# Altium project RedHatErrector.PrjPcb
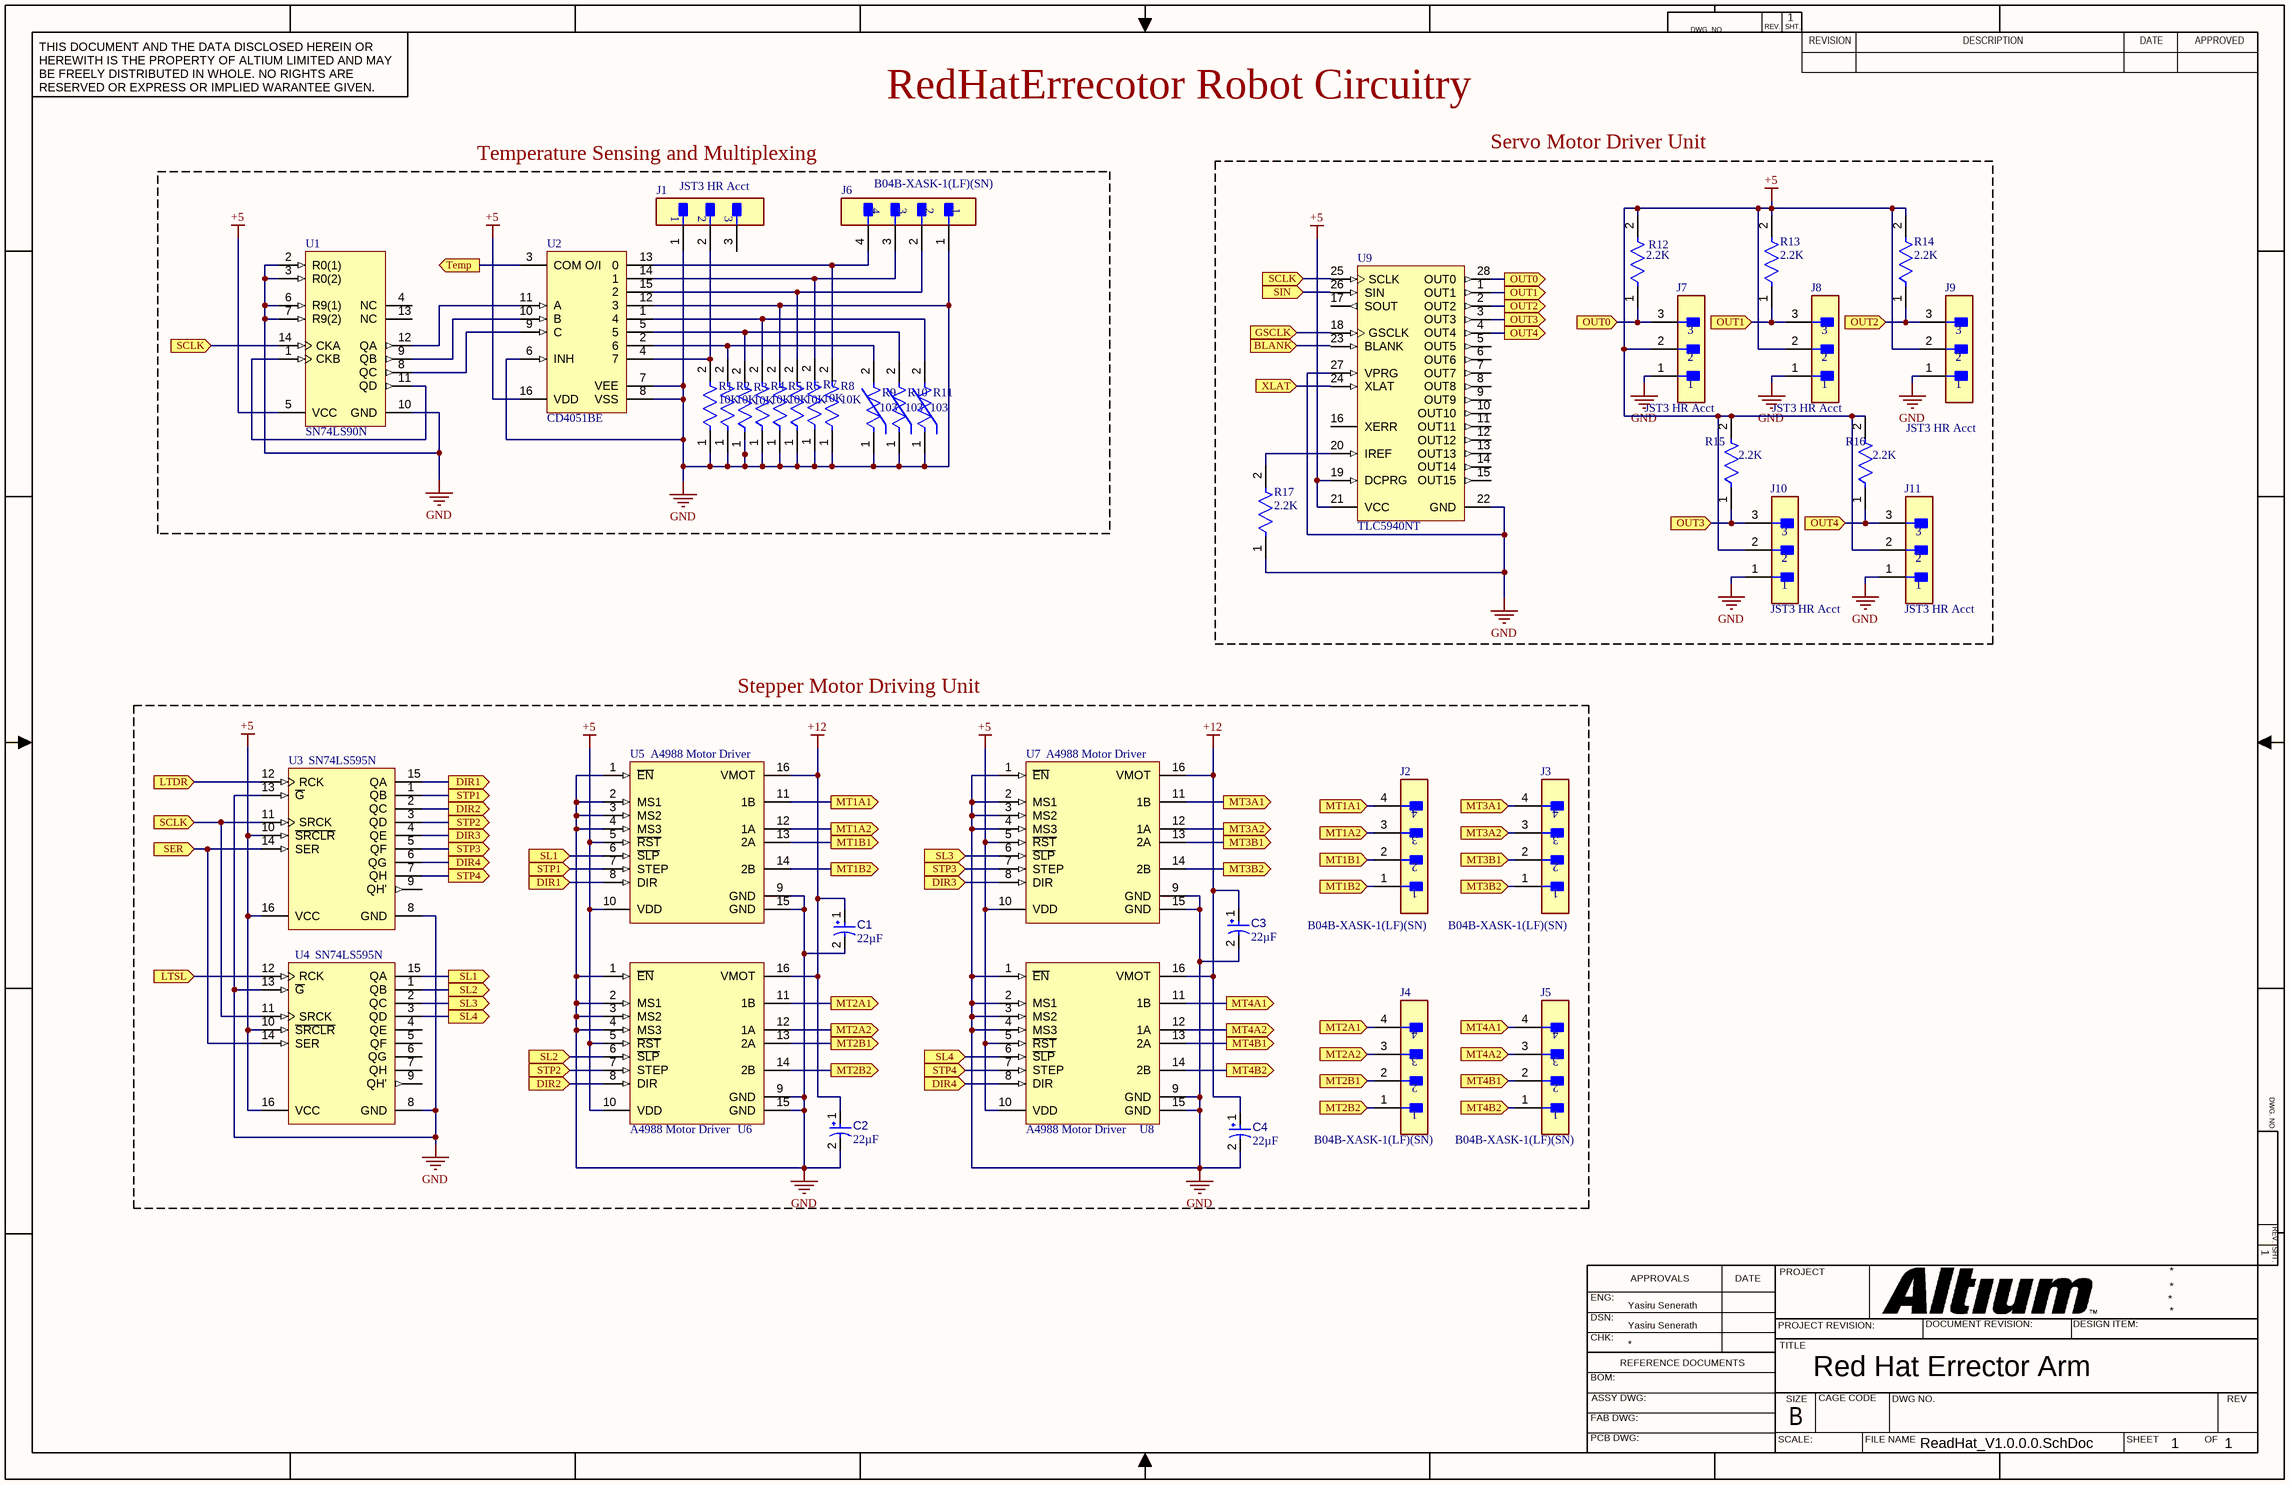
[diagram p0: ReadHat_V1.0.0.0.SchDoc]
1 sheet, 41 parts. Net scope: flat (ports and power ports of the same name join across sheets).
Board file: RedHatErrector PCB v1.0.0.0.PcbDoc

## Sheet ReadHat_V1.0.0.0.SchDoc: Red Hat Errector Arm
size 431 x 279 mm; Author: Yasiru Senerath; CompanyName: Red Hat; DrawnBy: Yasiru Senerath; Engineer: Yasiru Senerath; SheetNumber: 1; SheetTotal: 1

### Parts
C1  value 22µF  [CAPPR55-200-1100X500X1200]  (hidden comment: ECA1HM220)
C2  value 22µF  [CAPPR55-200-1100X500X1200]  (hidden comment: ECA1HM220)
C3  value 22µF  [CAPPR55-200-1100X500X1200]  (hidden comment: ECA1HM220)
C4  value 22µF  [CAPPR55-200-1100X500X1200]  (hidden comment: ECA1HM220)
J1  JST3 HR Acct  [FP-B3B-XH-A_LF_SN-MFG]
J2  B04B-XASK-1(LF)(SN)  [FP-B04B-XASK-1_LF_SN-MFG]
J3  B04B-XASK-1(LF)(SN)  [FP-B04B-XASK-1_LF_SN-MFG]
J4  B04B-XASK-1(LF)(SN)  [FP-B04B-XASK-1_LF_SN-MFG]
J5  B04B-XASK-1(LF)(SN)  [FP-B04B-XASK-1_LF_SN-MFG]
J6  B04B-XASK-1(LF)(SN)  [FP-B04B-XASK-1_LF_SN-MFG]
J7  JST3 HR Acct  [FP-B3B-XH-A_LF_SN-MFG]
J8  JST3 HR Acct  [FP-B3B-XH-A_LF_SN-MFG]
J9  JST3 HR Acct  [FP-B3B-XH-A_LF_SN-MFG]
J10  JST3 HR Acct  [FP-B3B-XH-A_LF_SN-MFG]
J11  JST3 HR Acct  [FP-B3B-XH-A_LF_SN-MFG]
R1  10K  [FP-RNC55-MFG]
R2  10K  [FP-RNC55-MFG]
R3  10K  [FP-RNC55-MFG]
R4  10K  [FP-RNC55-MFG]
R5  10K  [FP-RNC55-MFG]
R6  10K  [FP-RNC55-MFG]
R7  10K  [FP-RNC55-MFG]
R8  10K  [FP-RNC55-MFG]
R9  103  [FP-PTFL04_2N34-MFG]
R10  103  [FP-PTFL04_2N34-MFG]
R11  103  [FP-PTFL04_2N34-MFG]
R12  2.2K  [FP-RNC55-MFG]
R13  2.2K  [FP-RNC55-MFG]
R14  2.2K  [FP-RNC55-MFG]
R15  2.2K  [FP-RNC55-MFG]
R16  2.2K  [FP-RNC55-MFG]
R17  2.2K  [FP-RNC55-MFG]
U1  SN74LS90N  [N0014A]
U2  CD4051BE  [N0016A]
U3  SN74LS595N  [N0016A]
U4  SN74LS595N  [N0016A]
U5  A4988 Motor Driver  [Polo-A4988 Motor Driver_V]
U6  A4988 Motor Driver  [Polo-A4988 Motor Driver_V]
U7  A4988 Motor Driver  [Polo-A4988 Motor Driver_V]
U8  A4988 Motor Driver  [Polo-A4988 Motor Driver_V]
U9  TLC5940NT  [NT0028A]

### Blocks framed on the sheet
Servo Motor Driver Unit: J7-J11 R12-R17 U9
Temperature Sensing and Multiplexing: J1 J6 R1-R11 U1 U2
Stepper Motor Driving Unit: C1-C4 J2-J5 U3-U8

### Ports
BLANK (in), DIR1 (in), DIR1 (out), DIR2 (in), DIR2 (out), DIR3 (in), DIR3 (out), DIR4 (in), DIR4 (out), GSCLK (in), LTDR (in), LTSL (in), MT1A1 (in), MT1A1 (out), MT1A2 (in), MT1A2 (out), MT1B1 (in), MT1B1 (out), MT1B2 (in), MT1B2 (out), MT2A1 (in), MT2A1 (out), MT2A2 (in), MT2A2 (out), MT2B1 (in), MT2B1 (out), MT2B2 (in), MT2B2 (out), MT3A1 (in), MT3A1 (out), MT3A2 (in), MT3A2 (out), MT3B1 (in), MT3B1 (out), MT3B2 (in), MT3B2 (out), MT4A1 (in), MT4A1 (out), MT4A2 (in), MT4A2 (out), MT4B1 (in), MT4B1 (out), MT4B2 (in), MT4B2 (out), OUT0 (in), OUT0 (out), OUT1 (in), OUT1 (out), OUT2 (in), OUT2 (out), OUT3 (in), OUT3 (out), OUT4 (in), OUT4 (out), SCLK (in), SER (in), SIN (in), SL1 (in), SL1 (out), SL2 (in), SL2 (out), SL3 (in), SL3 (out), SL4 (in), SL4 (out), STP1 (in), STP1 (out), STP2 (in), STP2 (out), STP3 (in), STP3 (out), STP4 (in), STP4 (out), Temp (out), XLAT (in)

### Nets
+5: J7.2 J8.2 J9.2 J10.2 J11.2 R12.2 R13.2 R14.2 R15.2 R16.2 U1.5(VCC) U2.16(VDD) U3.10(~{SRCLR}) U3.16(VCC) U4.10(~{SRCLR}) U4.16(VCC) U5.5(~{RST}) U5.10(VDD) U6.5(~{RST}) U6.10(VDD) U7.5(~{RST}) U7.10(VDD) U8.5(~{RST}) U8.10(VDD) U9.19(DCPRG) U9.21(VCC)
+12: C1.1 C2.1 C3.1 C4.1 U5.16(VMOT) U6.16(VMOT) U7.16(VMOT) U8.16(VMOT)
GND: C1.2 C2.2 C3.2 C4.2 J1.1 J6.1 J7.1 J8.1 J9.1 J10.1 J11.1 R1.1 R2.1 R3.1 R4.1 R5.1 R5.2 R6.1 R7.1 R8.1 R9.1 R10.1 R11.1 R17.1 U1.2(R0(1)) U1.3(R0(2)) U1.6(R9(1)) U1.7(R9(2)) U1.10(GND) U2.6(INH) U2.7(VEE) U2.8(VSS) U2.12(3) U3.8(GND) U3.13(~{G}) U4.8(GND) U4.13(~{G}) U5.1(~{EN}) U5.2(MS1) U5.3(MS2) U5.4(MS3) U5.9(GND) U5.15(GND) U6.1(~{EN}) U6.2(MS1) U6.3(MS2) U6.4(MS3) U6.9(GND) U6.15(GND) U7.1(~{EN}) U7.2(MS1) U7.3(MS2) U7.4(MS3) U7.9(GND) U7.15(GND) U8.1(~{EN}) U8.2(MS1) U8.3(MS2) U8.4(MS3) U8.9(GND) U8.15(GND) U9.22(GND) U9.27(VPRG)
NetJ1_2: J1.2 R1.2 U2.4(7)
NetJ2_1: J2.1 U5.14(2B) ; port MT1B2
NetJ2_2: J2.2 U5.13(2A) ; port MT1B1
NetJ2_3: J2.3 U5.12(1A) ; port MT1A2
NetJ2_4: J2.4 U5.11(1B) ; port MT1A1
NetJ3_1: J3.1 U7.14(2B) ; port MT3B2
NetJ3_2: J3.2 U7.13(2A) ; port MT3B1
NetJ3_3: J3.3 U7.12(1A) ; port MT3A2
NetJ3_4: J3.4 U7.11(1B) ; port MT3A1
NetJ4_1: J4.1 U6.14(2B) ; port MT2B2
NetJ4_2: J4.2 U6.13(2A) ; port MT2B1
NetJ4_3: J4.3 U6.12(1A) ; port MT2A2
NetJ4_4: J4.4 U6.11(1B) ; port MT2A1
NetJ5_1: J5.1 U8.14(2B) ; port MT4B2
NetJ5_2: J5.2 U8.13(2A) ; port MT4B1
NetJ5_3: J5.3 U8.12(1A) ; port MT4A2
NetJ5_4: J5.4 U8.11(1B) ; port MT4A1
NetJ6_2: J6.2 R6.2 U2.15(2)
NetJ6_3: J6.3 R7.2 U2.14(1)
NetJ6_4: J6.4 R8.2 U2.13(0)
NetJ7_3: J7.3 R12.1 U9.28(OUT0) ; port OUT0
NetJ8_3: J8.3 R13.1 U9.1(OUT1) ; port OUT1
NetJ9_3: J9.3 R14.1 U9.2(OUT2) ; port OUT2
NetJ10_3: J10.3 R15.1 U9.3(OUT3) ; port OUT3
NetJ11_3: J11.3 R16.1 U9.4(OUT4) ; port OUT4
NetR2_2: R2.2 R9.2 U2.2(6)
NetR3_2: R3.2 R10.2 U2.5
NetR4_2: R4.2 R11.2 U2.1(4)
NetR17_2: R17.2 U9.20(IREF)
NetU1_1: U1.1(CKB) U1.11(QD)
NetU1_8: U1.8(QC) U2.9(C)
NetU1_9: U1.9(QB) U2.10(B)
NetU1_12: U1.12(QA) U2.11(A)
NetU1_14: U1.14(CKA) U3.11(SRCK) U4.11(SRCK) U9.25(SCLK) ; port SCLK
NetU2_3: U2.3(COM_O/I) ; port Temp
NetU3_1: U3.1(QB) U5.7(STEP) ; port STP1
NetU3_2: U3.2(QC) U6.8(DIR) ; port DIR2
NetU3_3: U3.3(QD) U6.7(STEP) ; port STP2
NetU3_4: U3.4(QE) U7.8(DIR) ; port DIR3
NetU3_5: U3.5(QF) U7.7(STEP) ; port STP3
NetU3_6: U3.6(QG) U8.8(DIR) ; port DIR4
NetU3_7: U3.7(QH) U8.7(STEP) ; port STP4
NetU3_12: U3.12(RCK) ; port LTDR
NetU3_14: U3.14(SER) U4.14(SER) ; port SER
NetU3_15: U3.15(QA) U5.8(DIR) ; port DIR1
NetU4_1: U4.1(QB) U6.6(~{SLP}) ; port SL2
NetU4_2: U4.2(QC) U7.6(~{SLP}) ; port SL3
NetU4_3: U4.3(QD) U8.6(~{SLP}) ; port SL4
NetU4_12: U4.12(RCK) ; port LTSL
NetU4_15: U4.15(QA) U5.6(~{SLP}) ; port SL1
NetU9_18: U9.18(GSCLK) ; port GSCLK
NetU9_24: U9.24(XLAT) ; port XLAT

Not connected (* = marked no-connect by the designer): J1 3; U1 4(NC) 13(NC); U3 9(QH'); U4 4(QE) 5(QF) 6(QG) 7(QH) 9(QH'); U9 5(OUT5) 6(OUT6) 7(OUT7) 8(OUT8) 9(OUT9) 10(OUT10) 11(OUT11) 12(OUT12) 13(OUT13) 14(OUT14) 15(OUT15) 16(XERR) 17(SOUT) 23(BLANK) 26(SIN)

### Notes on the sheet
- RedHatErrecotor Robot Circuitry
- DWG. NO.
- REV.
- SHT.
- THIS DOCUMENT AND THE DATA DISCLOSED HEREIN OR HEREWITH IS THE PROPERTY OF ALTIUM LIMITED AND MAY BE FREELY DISTRIBUTED IN WHOLE. NO RIGHTS ARE RESERVED OR EXPRESS OR IMPLIED WARANTEE GIVEN.
- REVISION
- DESCRIPTION
- DATE
- APPROVED
- ENG:
- APPROVALS
- PROJECT
- DSN:
- CHK:
- REFERENCE DOCUMENTS
- PROJECT REVISION:
- TITLE
- DOCUMENT REVISION:
- DESIGN ITEM:
- BOM:
- FAB DWG:
- PCB DWG:
- ASSY DWG:
- SCALE:
- SIZE
- B
- CAGE CODE
- FILE NAME
- DWG NO.
- SHEET
- OF
- REV

### Library data of the parts
C1-C4 = CMP-001-00027-7: Aluminum Electrolytic Capacitor, 22 uF, +/- 20%, 50 V, -40 to 85 degC, 2-Pin THD, RoHS, Bulk; Manufacturer: Panasonic; Ripple Current (AC): 100mA; Voltage Rating: 50V; Pins: 2; Case/Package: Radial; Datasheet Version: Rev. 05, 10/2016; RoHS Compliant: True; Max Operating Temperature: 85°C; Ripple Current: 100mA; Capacitor Type: Electrolytic; Mounting Technology: TH; Package Quantity: 200; Package Reference: CAPPR55-200-1100X500X1200; Package Description: 2-Pin Radial Lead, Dia 5 mm, Height 12 mm; Packaging: Bulk; Lead Pitch: 2mm; Min Operating Temperature: -40°C; Diameter: 5mm; Tolerance: 20%; Datasheet URL: https://industrial.panasonic.com/cdbs/www-data/pdf/RDF0000/ABA0000C1218.pdf; Manufacturer URL: http://www.panasonic.com/
J1 J7-J11 = CMP-17439-000014-2: CONN HEADER VERT 3POS 2.5MM; Number of Positions: 3; Contact Resistance: 20mR; Max Current Rating: 3A; Gender: Male; Wire/Cable Gauge: 22AWG; Insulation Resistance: 1GR; Max Voltage Rating (DC): 250V; REACH SVHC: No SVHC; Lead Free: Lead Free; Packaging: Bulk; Pitch: 2.5mm; Housing Color: White; Number of Rows: 1; Housing Material: Polyamide; Termination: Solder; Series: XH; Fastening Type: Detent; Contact Plating: Tin; Contact Finish - Mating: TIN; Insulation Material: Nylon; Number of Contacts: 3; Max Operating Temperature: 85°C; Color: Natural; Contact Type: Male Pin; Mount: Through Hole; Current Rating: 3A; Orientation: Straight; Min Operating Temperature: -25°C; Connector Type: Header; Lead Pitch: 2.5mm; Contact Material: Brass; Length: 9.9mm; Insulation Color: Natural; Voltage Rating (AC): 250V; Max Voltage Rating (AC): 250V; Contact Shape: Square; Flammability Rating: UL94 V-0; Depth: 5.75mm; Voltage Rating: 250V
J2-J6 = CMP-17439-000018-1: CONN HEADER VERT 4POS 2.5MM; Manufacturer: JST; Current Rating: 3A; Voltage Rating: 250V; Conn Orientation: Straight; Conn Gender: Male; Number Of Contacts: 4; ComponentLink2Description: Datasheet; Package: B04B-XASK-1(LF)(SN); Octopart: https://octopart.com/b04b-xask-1%28lf%29%28sn%29-jst-3990149; Pitch: 2.5mm; Device Class L1: Connectors; RoHS: TRUE; Device Class L3: unset; Manufacturer Part Number: B04B-XASK-1(LF)(SN); Temperature Range High: +85°C; Height: 8.8mm; Lead Free: Yes; Category: Conn; Temperature: -25°C to +85°C; Digikey Description: CONN HEADER VERT 4POS 2.5MM; Temperature Range Low: -25°C; ComponentLink2URL: http://www.jst-mfg.com/product/pdf/eng/eXA1.pdf; Contact Material: Tin,Copper; Device Class L2: Headers and Wire Housings; Automotive: No; Number Of Rows: 1
R1-R8 R13-R17 = CMP-02408-000004-1: RES 10K OHM 1/8W 1% AXIAL; Manufacturer Part Number: RNC55H1002FSB14; Manufacturer: Vishay; Voltage Rating: 200V; Power Rating: 0.125W; Resistance: 10kΩ; Temperature Coefficient: 50ppm/°C; Value: 10kΩ; Automotive: No; Category: Res; Tolerance: 1%; Temperature: -65°C to +175°C; Device Class L2: Resistors; Composition: Metal Film; Height: 2.69mm; Failure Rate: 0.001%; ComponentLink2URL: https://www.vishay.com/docs/31025/erc.pdf; Temperature Range High: +175°C; Lead Free: No; Series: RNC; Device Class L1: Passive Components; Ipc Land Pattern Name: RESAD1100W85L762D269; Octopart: https://octopart.com/rnc55h1002fs-vishay-40848808; Package: RNC55; RoHS: FALSE; Military Standard: true; Device Class L3: Through-Hole Resistors; ComponentLink2Description: Datasheet; Digikey Description: RES 10K OHM 1/8W 1% AXIAL; Temperature Range Low: -65°C
R9-R11 = CMP-06022-000451-1: THERMISTOR PTC 100 OHM DISC; Lead Length: 25mm; Resistance: 100R; Current Rating: 100mA; Voltage: 16V; Package Quantity: 400; Mount: Through Hole; Depth: 4mm; Packaging: Bulk; Number of Pins: 2; REACH SVHC: No SVHC; Termination: Radial; Case/Package: Radial; Max Supply Voltage: 16V; Min Operating Temperature: -10°C; Max Operating Temperature: 130°C
R12 = CMP-02408-000004-1: RES 5K OHM 1/8W 1% AXIAL; Manufacturer Part Number: RNC55H1002FSB14; Manufacturer: Vishay; Voltage Rating: 200V; Power Rating: 0.125W; Resistance: 10kΩ; Temperature Coefficient: 50ppm/°C; Value: 10kΩ; Automotive: No; Category: Res; Tolerance: 1%; Temperature: -65°C to +175°C; Device Class L2: Resistors; Composition: Metal Film; Height: 2.69mm; Failure Rate: 0.001%; ComponentLink2URL: https://www.vishay.com/docs/31025/erc.pdf; Temperature Range High: +175°C; Lead Free: No; Series: RNC; Device Class L1: Passive Components; Ipc Land Pattern Name: RESAD1100W85L762D269; Octopart: https://octopart.com/rnc55h1002fs-vishay-40848808; Package: RNC55; RoHS: FALSE; Military Standard: true; Device Class L3: Through-Hole Resistors; ComponentLink2Description: Datasheet; Digikey Description: RES 10K OHM 1/8W 1% AXIAL; Temperature Range Low: -65°C
U1 = CMP-1623-00486-2: Decade Counter, N0014A, TUBE; Manufacturer: Texas Instruments; F @ Nom Voltage(Max)(Mhz): 35; VCC(Max)(V): 5.25; ICC @ Nom Voltage(Max)(mA): 15; Output Drive (IOL/IOH)(Max)(mA): 8/-0.4; Inputs: 1; Rating: Catalog; Voltage(Nom)(V): 5; Bits(#): 4; Technology Family: LS; VCC(Min)(V): 4.75; Schmitt Trigger: No; Input Type: TTL; tpd @ Nom Voltage(Max)(ns): 50; Output Type: CMOS; Type: Decade; PackageReference: N0014A; Code_JEDEC: MS-001; Operating Temperature Range(C): 0 to 70; Generic Part Number: SN74LS90; Function: Counter; DatasheetVersion: SDLS940A
U2 = CMP-1575-00059-4: CMOS Single 8-Channel Analog Multiplexer/Demultiplexer with Logic-Level Conversion, N0016A, TUBE; Manufacturer: Texas Instruments; VCC(Max)(V): 18; ICC(Typ)(mA): 0.00008; Output Drive (IOL/IOH)(Max)(mA): 1; Bandwidth(Max)(MHz): 20; Rating: Military; VCC(Min)(V): 5; Configuration: 1 X 1：8 MUX; Crosstalk: Yes; Ron(Max)(Ohms): 240; Ron(Typ)(Ohms): 125; DatasheetVersion: SCHS047G; Output Type: CMOS; PackageVersion: http://www.ti.com/lit/ml/mpdi002c/mpdi002c.pdf; Operating Temperature Range(C): -55 to 125; Generic Part Number: CD4051B; PackageReference: N0016A; Code_JEDEC: MS-001
U3 U4 = CMP-0780-00142-3: Serial-in shift registers with output registers, N0016A, TUBE; Manufacturer: Texas Instruments; ICC @ Nom Voltage(Max)(mA): 65; Rating: Catalog; tpd @ Nom Voltage(Max)(ns): 25; Output Drive (IOL/IOH)(Max)(mA): 24/-2.6; F @ Nom Voltage(Max)(Mhz): 35; VCC(Max)(V): 5.25; Bits: 8; VCC(Min)(V): 4.75; 3-State Output: Yes; Voltage(Nom)(V): 5; Technology Family: LS; Input Type: TTL; Operating Temperature Range(C): 0 to 70; DatasheetVersion: SDLS006; Code_JEDEC: MS-001; PackageVersion: http://www.ti.com/lit/ml/mpdi002c/mpdi002c.pdf; Generic Part Number: SN74LS595; PackageReference: N0016A; Output Type: TTL
U5-U8 = CMP-00024-00002-2: Stepper Motor Driver Carrier, 3 to 5.5 V, 2 A, 16-Pin THD; Manufacturer: Pololu Robotics & Electronics; Datasheet Version: Dec-15; Package Description: 16-Pin Through Hole Device, Body 20.3 x 15.2 mm, Pitch 2.54 mm; Case/Package: A4988MotorDriver; Mounting Technology: TH; RoHS Compliant: Unknown; Datasheet URL: https://www.pololu.com/file/0J1082/a4988-stepper-motor-driver-carrier-dimension-diagram.pdf; Package Reference: A4988 Motor Driver
U9 = CMP-0388-00347-2: 16-Channel LED Driver with EEprom DOT Correction & Grayscale PWM Control, 3 to 5.5 V, -40 to 85 degC, 28-pin DIP (NT28), Green (RoHS & no Sb/Br); Manufacturer: Texas Instruments; Vin(Min)(V): 3; Vin(Max)(V): 5.5; Rating: Catalog; Eco-Plan: Green (RoHS & no Sb/Br); DatasheetVersion: SLVS515C; ComponentLink2URL: http://www.ti.com/general/docs/lit/getliterature.tsp?genericPartNumber=TLC5940&fileType=pdf; ComponentLink2Description: Datasheet; ComponentLink3Description: Package Specification; SubFamily: LED Driver; ComponentLink3URL: http://www.ti.com/lit/ml/mpdi004a/mpdi004a.pdf; PartNumber: TLC5940NT; Mounting Technology: Through Hole; PackageVersion: 4040050/C; ComponentLink1URL: http://www.ti.com/; PackageReference: NT0028A; PackageDescription: 28-Lead, Plastic In-Line, Body Size 35.69 x 6.73 mm, Pitch 2.54 mm; ComponentLink1Description: Manufacturer URL